# Altium schematic sheet Microcontroller.SchDoc
size 241 x 190 mm; SheetNumber: 1; SheetTotal: 1
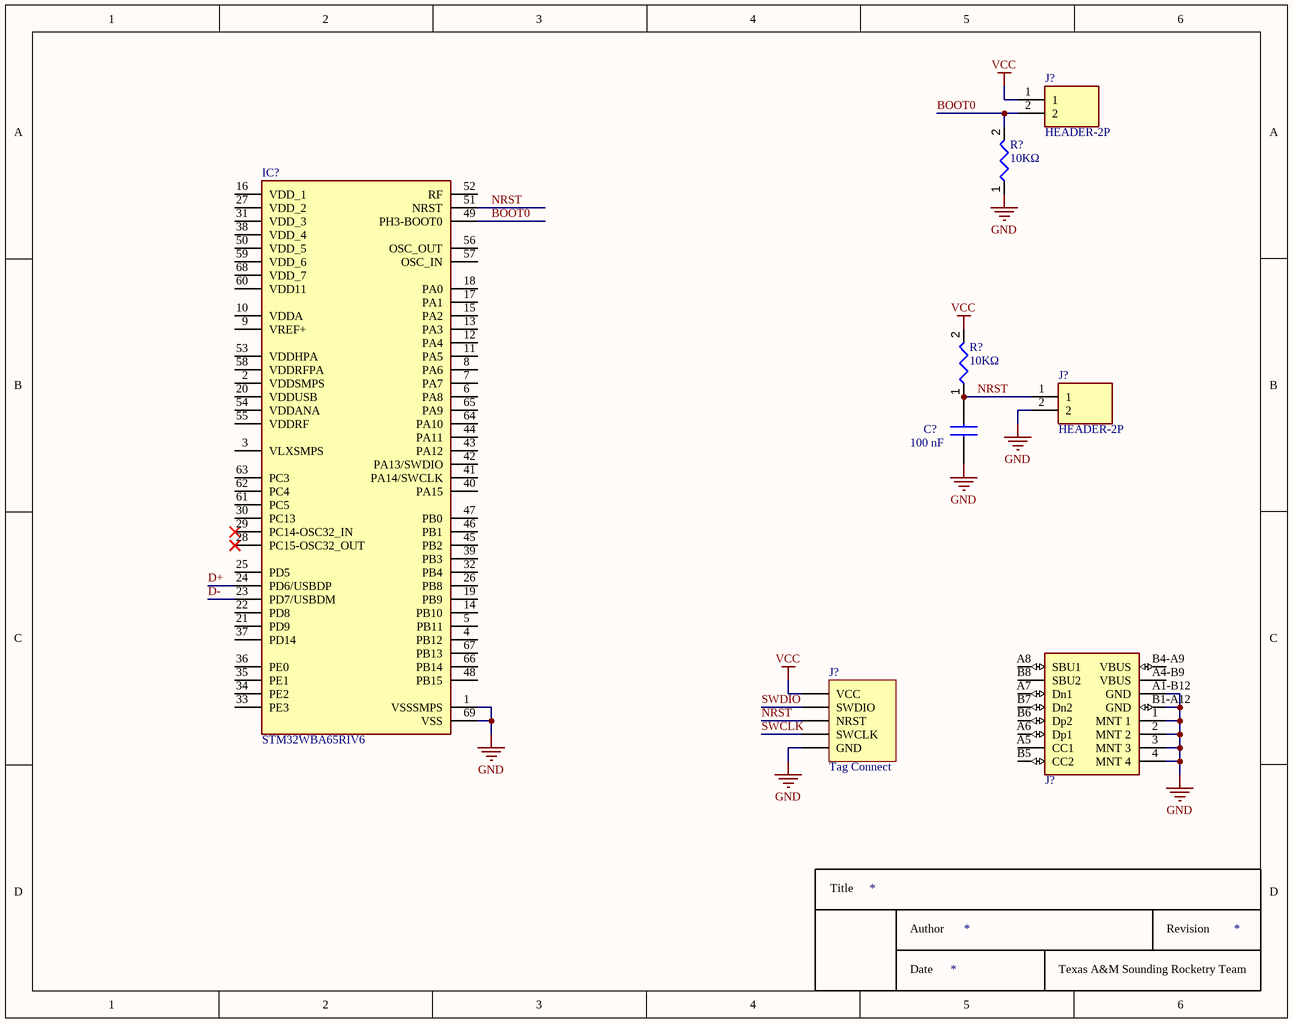
[diagram p0: Microcontroller.SchDoc]

## Parts
(Parts that share a designator on the sheet are numbered #1, #2 ... from top to bottom, then left to right.)
C?  100 nF  [CAP_0603]
IC?  STM32WBA65RIV6  [QFN40P800X800X100-69N-D]
J?#1  HEADER-2P  [HDRV2W110P0X254_1X2_508X254X854P]
J?#2  HEADER-2P  [HDRV2W110P0X254_1X2_508X254X854P]
J?#3  Tag Connect  [TC2030-MCP]
J?#4  USB-C  [FP-USB4105-GF-A-MFG]  (value not drawn)
R?#1  10KΩ  [RES_0603]
R?#2  10KΩ  [RES_0603]

## Nets
GND: C?.1 IC?.1(VSSSMPS) IC?.69(VSS) J?#2.2 J?#3.5(GND) J?#4.1(MNT_1) J?#4.2(MNT_2) J?#4.3(MNT_3) J?#4.4(MNT_4) J?#4.A1-B12(GND) J?#4.B1-A12(GND) R?#1.1
VCC: J?#1.1 J?#3.1(VCC) R?#2.2
BOOT0: IC?.49(PH3-BOOT0) J?#1.2 R?#1.2
D+: IC?.24(PD6/USBDP)
D-: IC?.23(PD7/USBDM)
NRST: C?.2 IC?.51(NRST) J?#2.1 J?#3.3(NRST) R?#2.1
SWCLK: J?#3.4(SWCLK)
SWDIO: J?#3.2(SWDIO)

Not connected (* = marked no-connect by the designer): IC? 2(VDDSMPS) 3(VLXSMPS) 4(PB12) 5(PB11) 6(PA8) 7(PA7) 8(PA6) 9(VREF+) 10(VDDA) 11(PA5) 12(PA4) 13(PA3) 14(PB10) 15(PA2) 16(VDD_1) 17(PA1) 18(PA0) 19(PB9) 20(VDDUSB) 21(PD9) 22(PD8) 25(PD5) 26(PB8) 27(VDD_2) 28(PC15-OSC32_OUT)* 29(PC14-OSC32_IN)* 30(PC13) 31(VDD_3) 32(PB4) 33(PE3) 34(PE2) 35(PE1) 36(PE0) 37(PD14) 38(VDD_4) 39(PB3) 40(PA15) 41(PA14/SWCLK) 42(PA13/SWDIO) 43(PA12) 44(PA11) 45(PB2) 46(PB1) 47(PB0) 48(PB15) 50(VDD_5) 52(RF) 53(VDDHPA) 54(VDDANA) 55(VDDRF) 56(OSC_OUT) 57(OSC_IN) 58(VDDRFPA) 59(VDD_6) 60(VDD11) 61(PC5) 62(PC4) 63(PC3) 64(PA10) 65(PA9) 66(PB14) 67(PB13) 68(VDD_7); J?#4 A4-B9(VBUS) A5(CC1) A6(Dp1) A7(Dn1) A8(SBU1) B4-A9(VBUS) B5(CC2) B6(Dp2) B7(Dn2) B8(SBU2)

## Notes on the sheet
- Title
- Author
- Date
- Texas A&M Sounding Rocketry Team
- Revision

## Library data of the parts
C? = 100 nF Capacitor, 0603: Multilayer Ceramic Capacitors MLCC - SMD/SMT KGM15BR71H104JT NEW GLOBAL PN 50V 0.1uF A 581-KGM15BR71H104JT; Manufacturer 1: KYOCERA AVX; Manufacturer Part Number 1: 06035C104JAT2A; Tolerance: 5%; Value: 100 nF; Voltage: 50 V; Package: 0603; Library Ref: Capacitor_BASE; Design Item ID: 100 nF Capacitor, 0603; Supplier 1: Mouser; Supplier Part Number 1: 581-06035C104JAT2A
IC? = STM32WBA65RIV6: Integrated Circuit; Manufacturer_Name: STMicroelectronics; Datasheet Link: https://www.st.com/resource/en/datasheet/stm32wba62ci.pdf; Height: 1mm; Manufacturer_Part_Number: STM32WBA65RIV6; Arrow Part Number: STM32WBA65RIV6; Arrow Price/Stock: https://www.arrow.com/en/products/stm32wba65riv6/stmicroelectronics?utm_currency=USD&region=nac
J?#1 J?#2 = HEADER-2P: Connector / 61300211121; Manufacturer_Name: Wurth Elektronik; Datasheet Link: https://componentsearchengine.com/Datasheets/2/61300211121.pdf; Height: 8.54mm; Manufacturer_Part_Number: 61300211121; Mouser Part Number: 710-61300211121; Mouser Price/Stock: https://www.mouser.co.uk/ProductDetail/Wurth-Elektronik/61300211121?qs=t4813l51qx%252B1A5GYDQxPlw%3D%3D; Supplier 1: Mouser; Supplier Part Number 1: 710-61300211121
J?#4 = USB-C: USB4105-GF-A; MPN: USB4105-GF-A; Supplier 1: Mouser; Supplier Part Number 1: 640-USB4105-GF-A
R?#1 R?#2 = 10 KOhm Resistor: Thick Film Resistors - SMD General Purpose Chip Resistor 0603, 10kOhms, 1%, 1/10W; Manufacturer 1: YAGEO; Manufacturer Part Number 1: RC0603FR-0710KL; Tolerance: 0.01; Power: 0.1W; Value: 10KΩ; Package: 0603; Library Ref: Resistor_BASE; Design Item ID: 10 KOhm Resistor; Supplier 1: Mouser; Supplier Part Number 1: 603-RC0603FR-0710KL